# EasyEDA Pro project desain pcb.eprj

# Schematic Schematic1
Board Name: Board1; Create Date: 2026-02-26; Page Name: P1; Project Name: dapriz; Schematic Name: Schematic1; Update Date: 2026-02-26; Company: EasyEDA.com; Page Size: A4; Version: V1.0
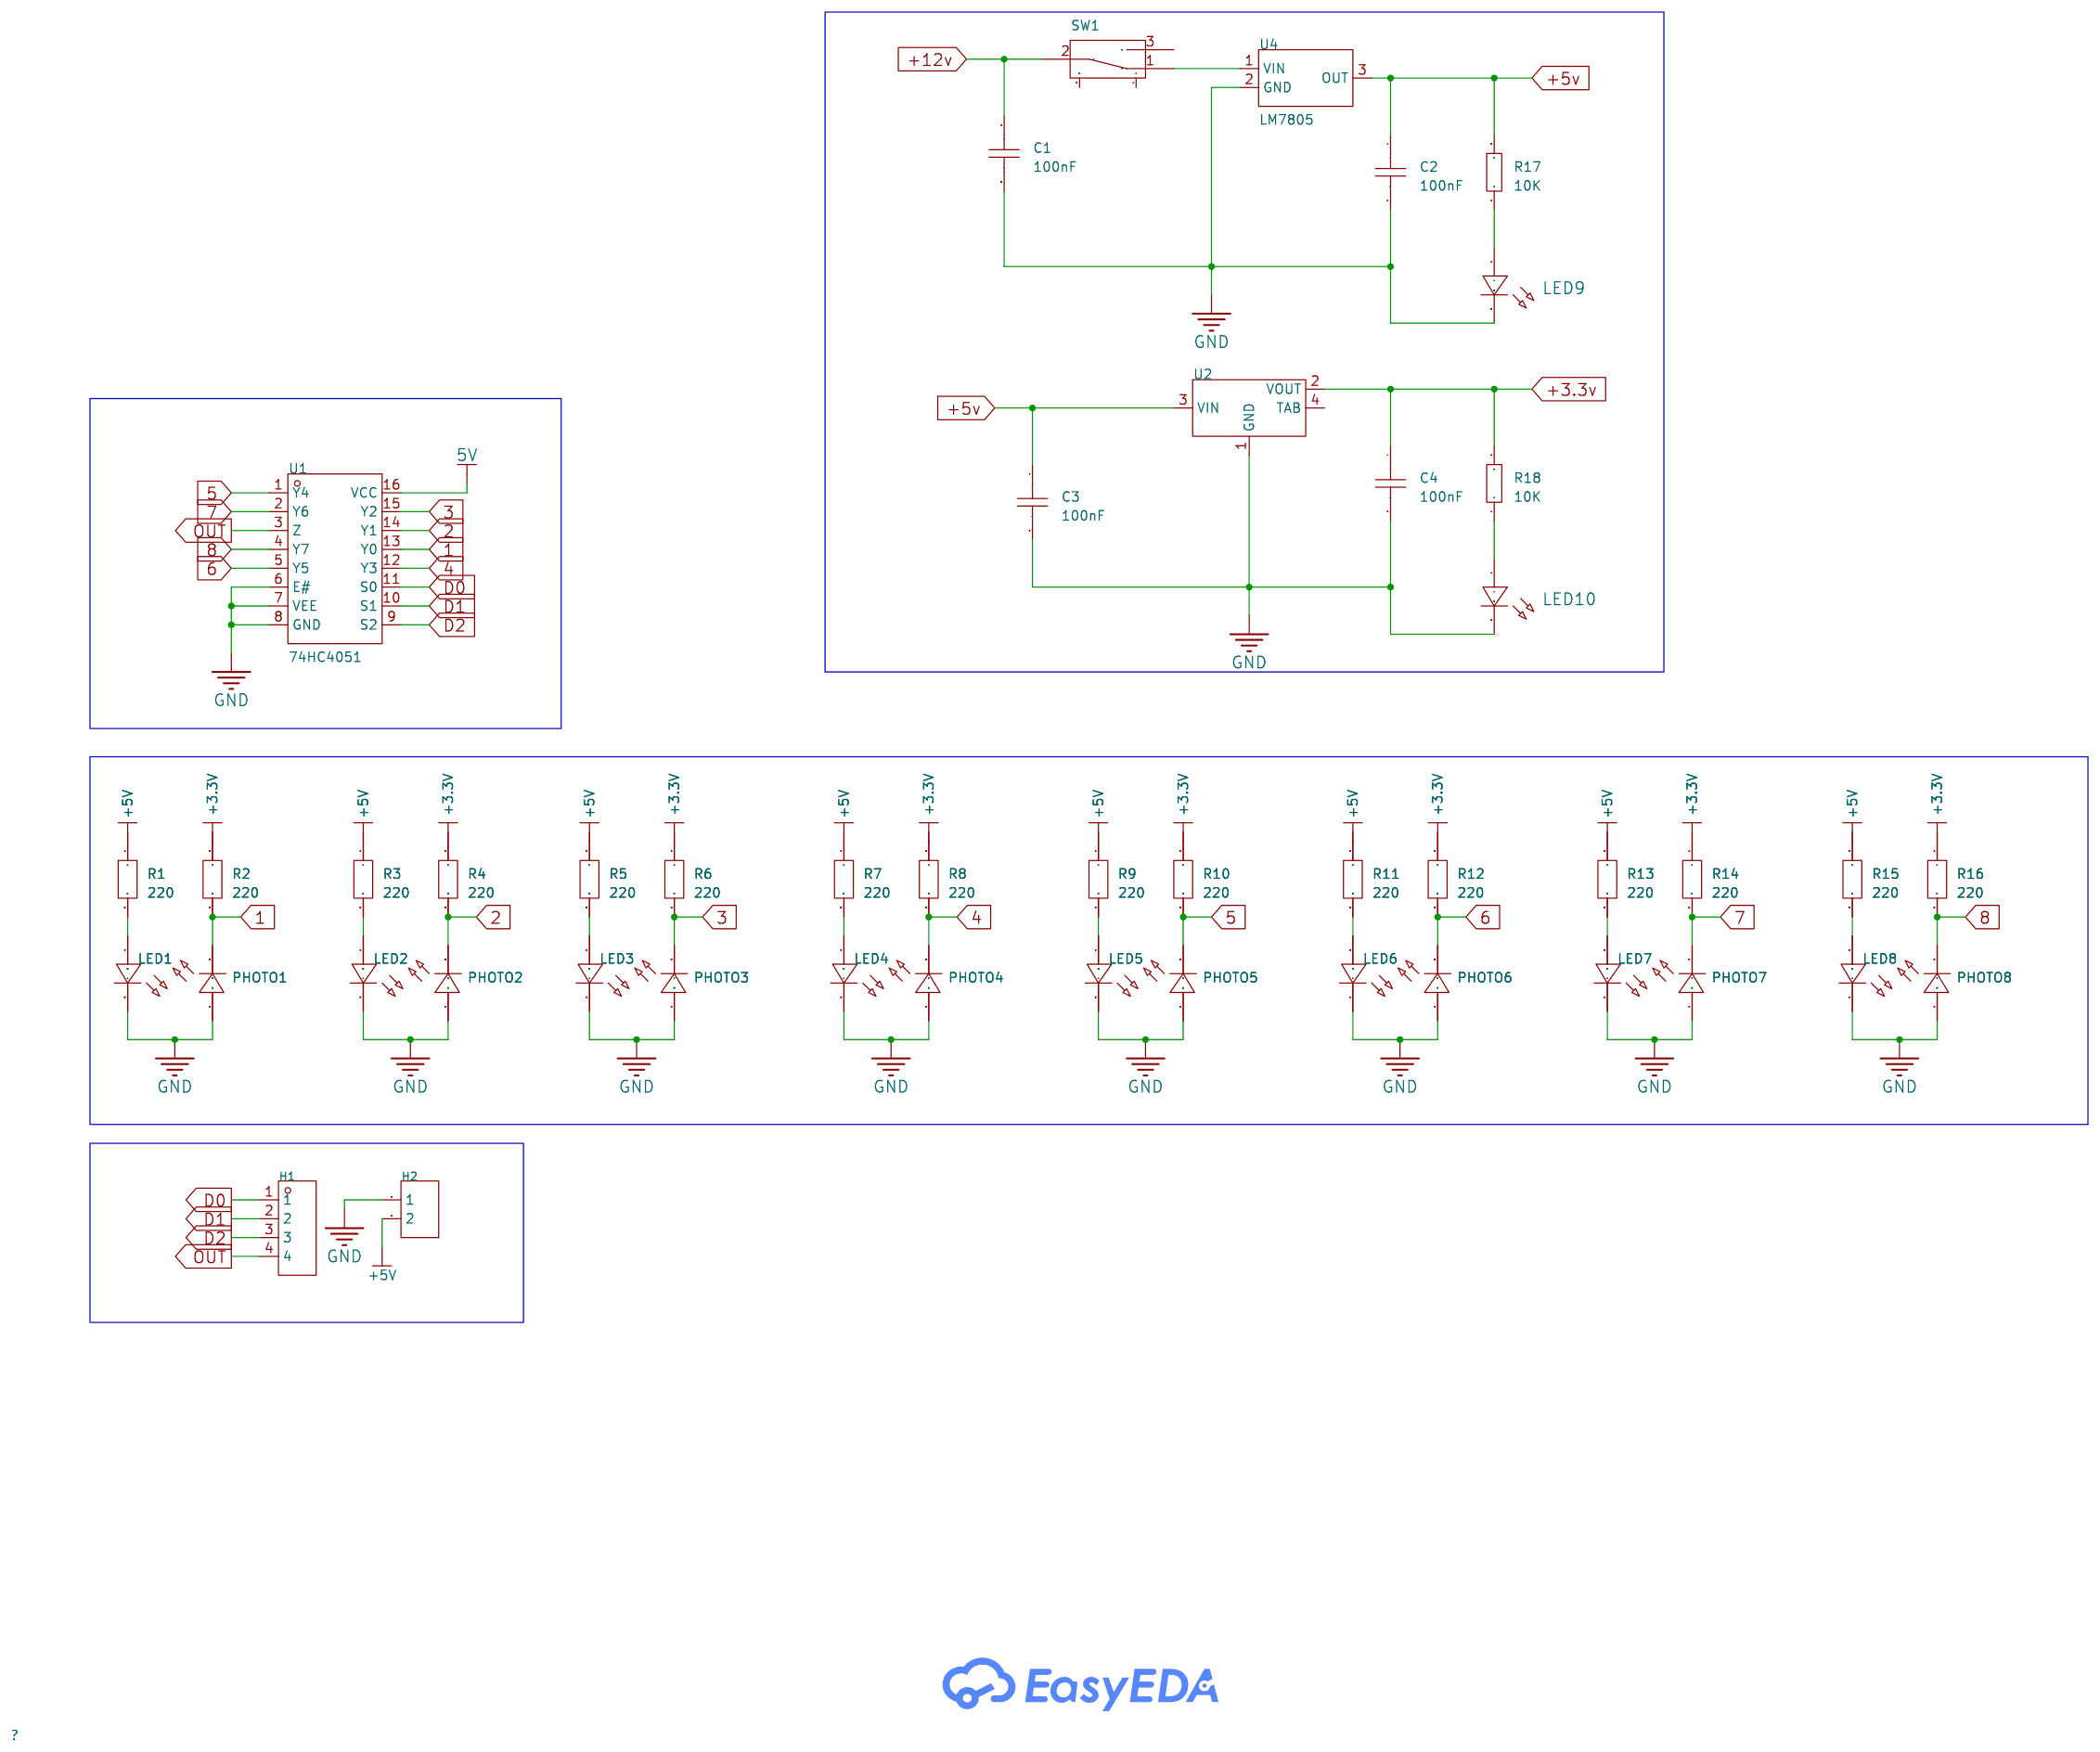
[diagram p0: schematic sheet]

## Parts
C1  100nF  [C0805]
C2  100nF  [C0805]
C3  100nF  [C0805]
C4  100nF  [C0805]
H1  -  [HDR-TH_4P-P2.54-V-F]
H2  -  [HDR-TH_2P-P2.54-V-F]
LED1  -  [LED-TH_BD3.0-P2.54-FD]
LED2  -  [LED-TH_BD3.0-P2.54-FD]
LED3  -  [LED-TH_BD3.0-P2.54-FD]
LED4  -  [LED-TH_BD3.0-P2.54-FD]
LED5  -  [LED-TH_BD3.0-P2.54-FD]
LED6  -  [LED-TH_BD3.0-P2.54-FD]
LED7  -  [LED-TH_BD3.0-P2.54-FD]
LED8  -  [LED-TH_BD3.0-P2.54-FD]
LED9  -  [LED0805-R-RD]
LED10  -  [LED0805-R-RD]
PHOTO1  -  [LED-TH_BD3.0-P2.54-FD]
PHOTO2  -  [LED-TH_BD3.0-P2.54-FD]
PHOTO3  -  [LED-TH_BD3.0-P2.54-FD]
PHOTO4  -  [LED-TH_BD3.0-P2.54-FD]
PHOTO5  -  [LED-TH_BD3.0-P2.54-FD]
PHOTO6  -  [LED-TH_BD3.0-P2.54-FD]
PHOTO7  -  [LED-TH_BD3.0-P2.54-FD]
PHOTO8  -  [LED-TH_BD3.0-P2.54-FD]
R1  220  [R0805]
R2  220  [R0805]
R3  220  [R0805]
R4  220  [R0805]
R5  220  [R0805]
R6  220  [R0805]
R7  220  [R0805]
R8  220  [R0805]
R9  220  [R0805]
R10  220  [R0805]
R11  220  [R0805]
R12  220  [R0805]
R13  220  [R0805]
R14  220  [R0805]
R15  220  [R0805]
R16  220  [R0805]
R17  10K  [R0603]
R18  10K  [R0603]
SW1  -  [SW-TH_SK12D07VG3]
U1  74HC4051  [SOP-16_L9.9-W3.9-P1.27-LS6.0-BL]
U2  -  [SOT-223-4_L6.5-W3.5-P2.30-LS7.0-BR]
U4  LM7805  [TO-252-2_L6.6-W6.1-P4.57-LS10.1-BL-1]

## Library data of the parts
C1-C4 = CAP_0805: Supplier Footprint: 0805
H1 = HDR-F_2.54_1x4P: Supplier Footprint: Through
H2 = HDR-F_2.54_1x2P: Supplier Footprint: Through
LED1-LED8 = LED_TH-R_3mm: Supplier Footprint: Through
LED9 LED10 = LED_0805-R: Supplier Footprint: 0805
PHOTO1-PHOTO8 = LED_TH-G_3mm: Supplier Footprint: Through
R1-R16 = PTFR0805B549RP9: Type:Thin Film Resistor Resistance: Tolerance:±0.1% Tolerance:±0.1% Power(Watts):130mW Overload Voltage (Max): Temperature Coefficient:±25ppm/℃ Temperature Coefficient:±25ppm/℃ Operating Temperature Range:-55℃~+155℃ Operating Temperature Range:-55℃~+155℃; LCSC Part Name: 薄膜电阻 549Ω ±0.1% 130mW; Supplier Part: C2849270; Manufacturer: RESI(开步睿思); Supplier Footprint: 0805; JLCPCB Part Class: Extended Part; Datasheet: https://atta.szlcsc.com/upload/public/pdf/source/20240506/11BDC7478D84177AC2A5326A65B6EB29.pdf; Supplier: LCSC; Type: Thin Film Resistor; Tolerance: ±0.1%; Power(Watts): 130mW; Temperature Coefficient: ±25ppm/℃; Operating Temperature Range: -55℃~+155℃
R17 R18 = Res_0603: Supplier Footprint: 0603
SW1 = SK12D07VG3: Supplier Footprint: Through
U1 = 74HC4051: LCSC Part Name: 8路模拟,多路复用器/解复用器; Supplier Part: C2943297; Manufacturer: I-CORE(中微爱芯); Supplier Footprint: SOP-16; JLCPCB Part Class: Extended Part; Datasheet: https://item.szlcsc.com/datasheet/74HC4051/3325956.html; Supplier: LCSC
U2 = AMS1117-3.3V: Supplier Footprint: SOT-223
U4 = LM7805: Supplier Part: C9900021893; Supplier Footprint: TO-252-2; JLCPCB Part Class: Extended Part; Supplier: LCSC

## Nets
5V: U1.16(VCC)
+3.3V: R2.1 R4.1 R6.1 R8.1 R10.1 R12.1 R14.1 R16.1
+3.3v: C4.1 R18.2 U2.2(VOUT)
+5V: H2.2 R1.1 R3.1 R5.1 R7.1 R9.1 R11.1 R13.1 R15.1
+5v: C2.1 C3.1 R17.2 U2.3(VIN) U4.3(OUT)
+12v: C1.1 SW1.2
GND: C1.2 C2.2 C3.2 C4.2 H2.1 LED1.2(A) LED2.2(A) LED3.2(A) LED4.2(A) LED5.2(A) LED6.2(A) LED7.2(A) LED8.2(A) LED9.2(C) LED10.2(C) PHOTO1.1(C) PHOTO2.1(C) PHOTO3.1(C) PHOTO4.1(C) PHOTO5.1(C) PHOTO6.1(C) PHOTO7.1(C) PHOTO8.1(C) U1.6(E#) U1.7(VEE) U1.8(GND) U2.1(GND) U4.2(GND)
1: PHOTO1.2(A) R2.2 U1.13(Y0)
2: PHOTO2.2(A) R4.2 U1.14(Y1)
3: PHOTO3.2(A) R6.2 U1.15(Y2)
4: PHOTO4.2(A) R8.2 U1.12(Y3)
5: PHOTO5.2(A) R10.2 U1.1(Y4)
6: PHOTO6.2(A) R12.2 U1.5(Y5)
7: PHOTO7.2(A) R14.2 U1.2(Y6)
8: PHOTO8.2(A) R16.2 U1.4(Y7)
D0: H1.1 U1.11(S0)
D1: H1.2 U1.10(S1)
D2: H1.3 U1.9(S2)
OUT: H1.4 U1.3(Z)
$1N915: LED1.1(C) R1.2
$1N1095: LED2.1(C) R3.2
$1N1273: LED3.1(C) R5.2
$1N1451: LED4.1(C) R7.2
$1N1629: LED5.1(C) R9.2
$1N1807: LED6.1(C) R11.2
$1N1985: LED7.1(C) R13.2
$1N2163: LED8.1(C) R15.2
$1N4562: LED10.1(A) R18.1
$1N4566: LED9.1(A) R17.1
$1N4575: SW1.1 U4.1(VIN)

Not connected (* = marked no-connect by the designer): SW1 3 4 5; U2 4(TAB)

# Schematic Schematic2
Board Name: Board2; Create Date: 2026-02-26; Page Name: P1; Project Name: dapriz; Schematic Name: Schematic2; Update Date: 2026-02-27; Company: EasyEDA.com; Page Size: A4; Version: V1.0
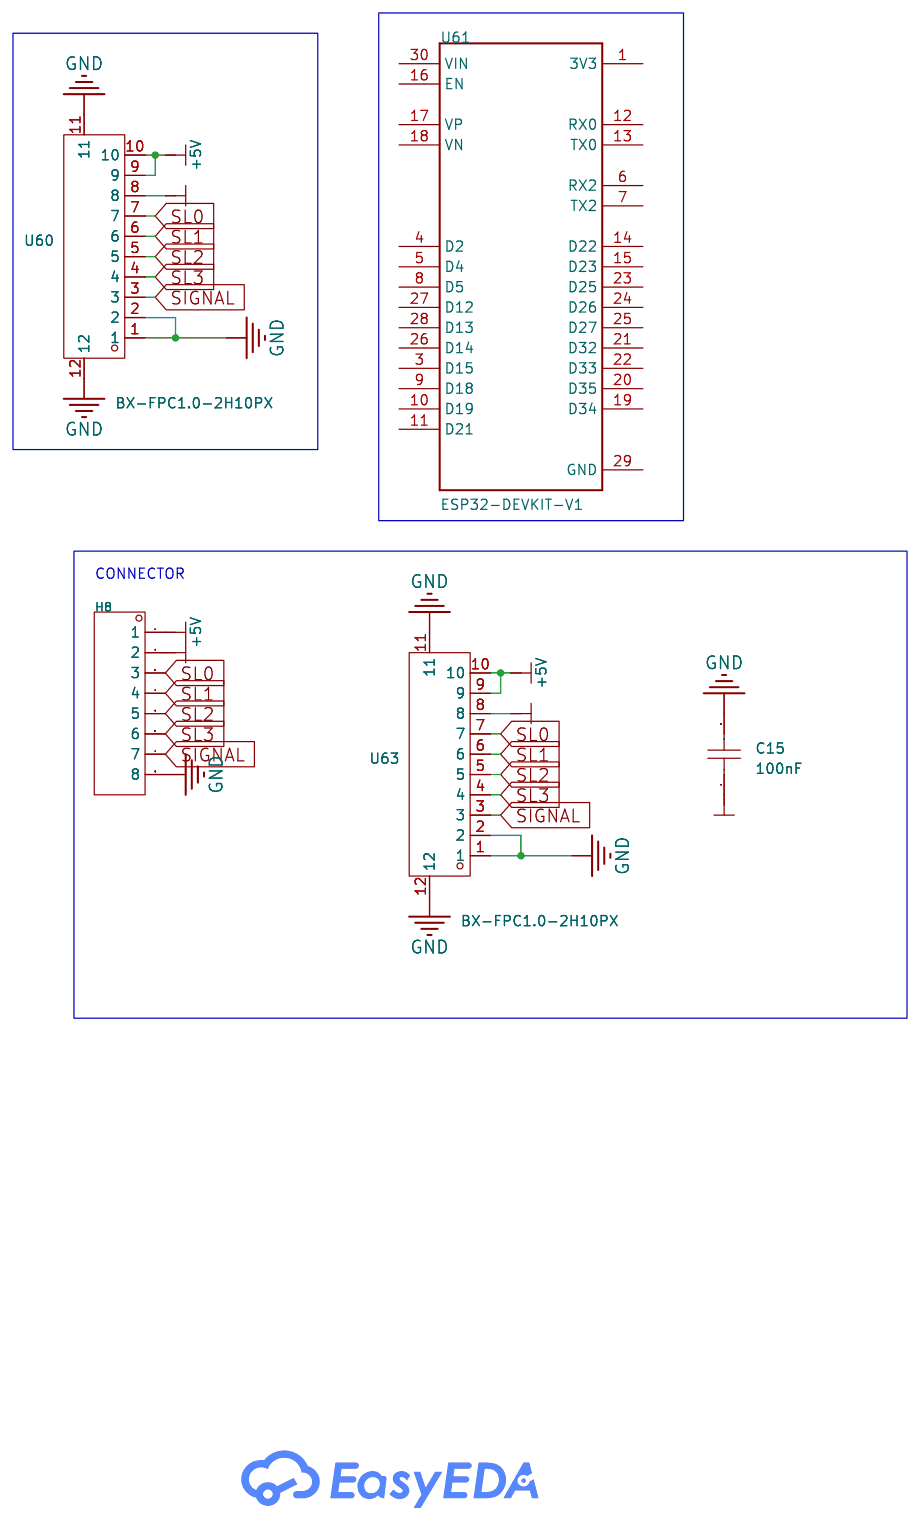
[diagram p1: schematic sheet]

## Parts
C15  100nF  [C0805]
H8  -  [HDR-TH_8P-P2.54-V-M]
U60  BX-FPC1.0-2H10PX  [FPC-SMD_10P-P1.00_BOSSIE_BX-FPC1.0-2H10PX]
U61  ESP32-DEVKIT-V1  [MODULE_ESP32_DEVKIT_V1]
U63  BX-FPC1.0-2H10PX  [FPC-SMD_10P-P1.00_BOSSIE_BX-FPC1.0-2H10PX]

## Library data of the parts
C15 = CAP_0805: Supplier Footprint: 0805
H8 = HDR-M_2.54_1x8P: Supplier Footprint: Through
U60 U63 = BX-FPC1.0-2H10PX: Locking Feature:Hinged Lid Contact Type:Bottom Contact Number of Contacts:10P Pitch:1mm Mounting Type:Surface Mount, Right Angle FFC, FCB Thickness:0.3mm FFC, FCB Thickness:0.3mm Height Above Board:2mm Contact Material:Copper Alloy Contact Plating:Tin Ope; LCSC Part Name: 翻盖式 下接 P数:10P 间距:1mm; Supplier Part: C18077668; Manufacturer: Bossie(博锡); Supplier Footprint: SMD,P=1mm,卧贴; JLCPCB Part Class: Extended Part; Datasheet: https://item.szlcsc.com/datasheet/BX-FPC1.0-2H10PX/19218069.html; Supplier: LCSC; Locking Feature: Hinged Lid; Contact Type: Bottom Contact; Number of Contacts: 10P; Pitch: 1mm; Mounting Type: Surface Mount, Right Angle; FFC, FCB Thickness: 0.3mm; Height Above Board: 2mm; Contact Material: Copper Alloy; Contact Plating: Tin; Operating Temperature: -25℃~+85℃
U61 = ESP32-DEVKIT-V1

## Nets
+3.3V: C15.1 H8.2 U60.8 U63.8
+5V: H8.1 U60.9 U60.10 U63.9 U63.10
GND: C15.2 H8.8 U60.1 U60.2 U60.11 U60.12 U63.1 U63.2 U63.11 U63.12
SIGNAL: H8.7 U60.3 U63.3
SL0: H8.3 U60.7 U63.7
SL1: H8.4 U60.6 U63.6
SL2: H8.5 U60.5 U63.5
SL3: H8.6 U60.4 U63.4

Not connected (* = marked no-connect by the designer): U61 1(3V3) 3(D15) 4(D2) 5(D4) 6(RX2) 7(TX2) 8(D5) 9(D18) 10(D19) 11(D21) 12(RX0) 13(TX0) 14(D22) 15(D23) 16(EN) 17(VP) 18(VN) 19(D34) 20(D35) 21(D32) 22(D33) 23(D25) 24(D26) 25(D27) 26(D14) 27(D12) 28(D13) 29(GND) 30(VIN)

## Notes on the sheet
- CONNECTOR

# Board PCB1
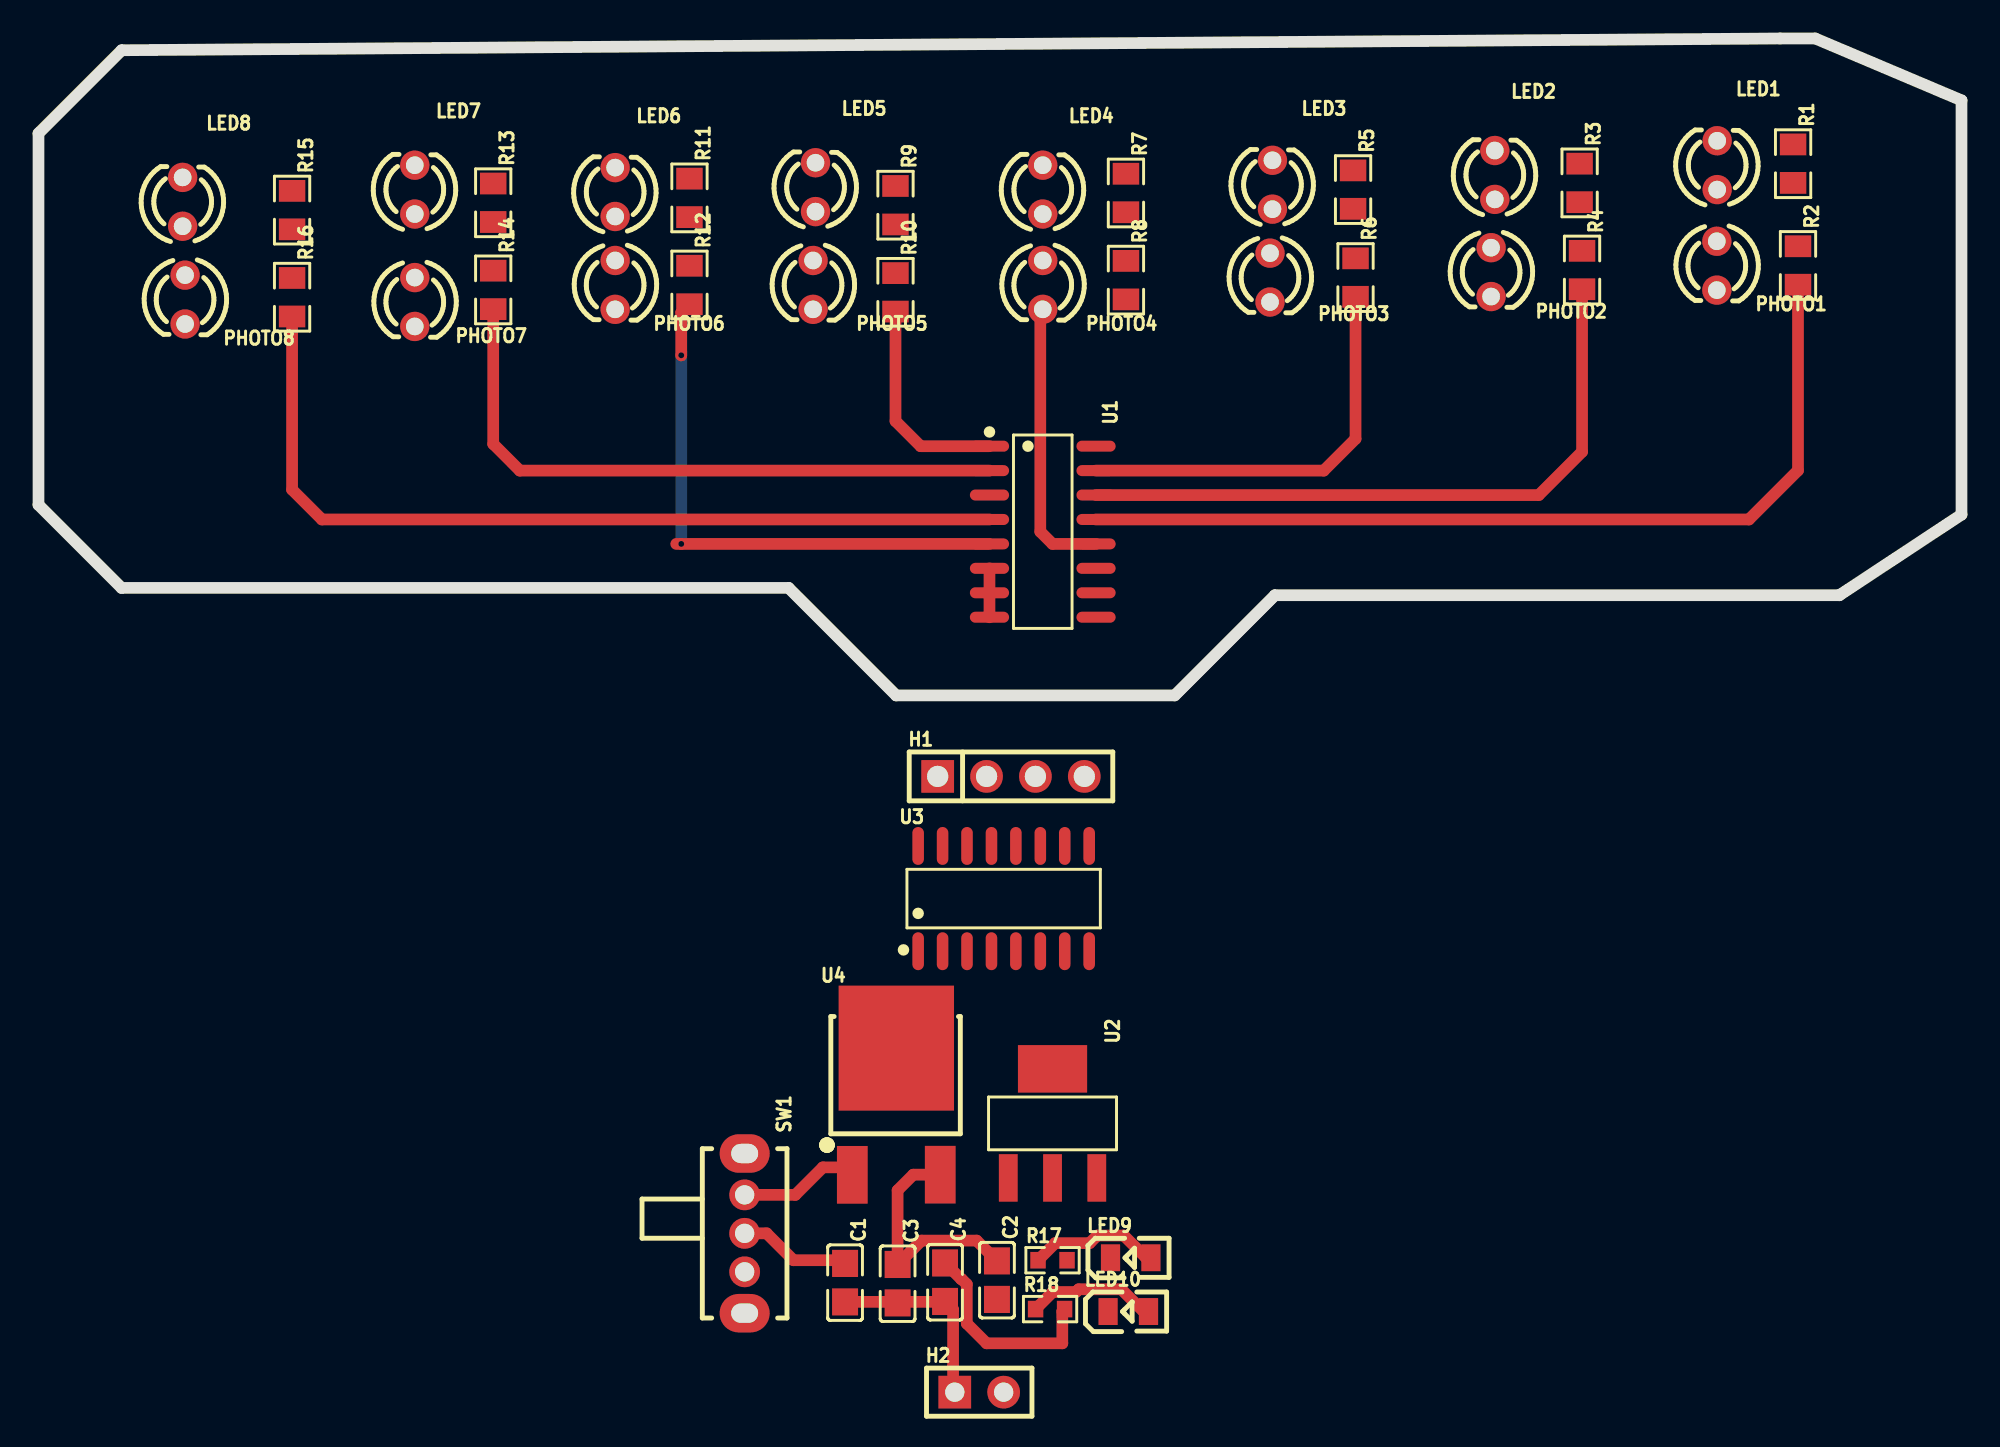
[diagram p2: board, top side]
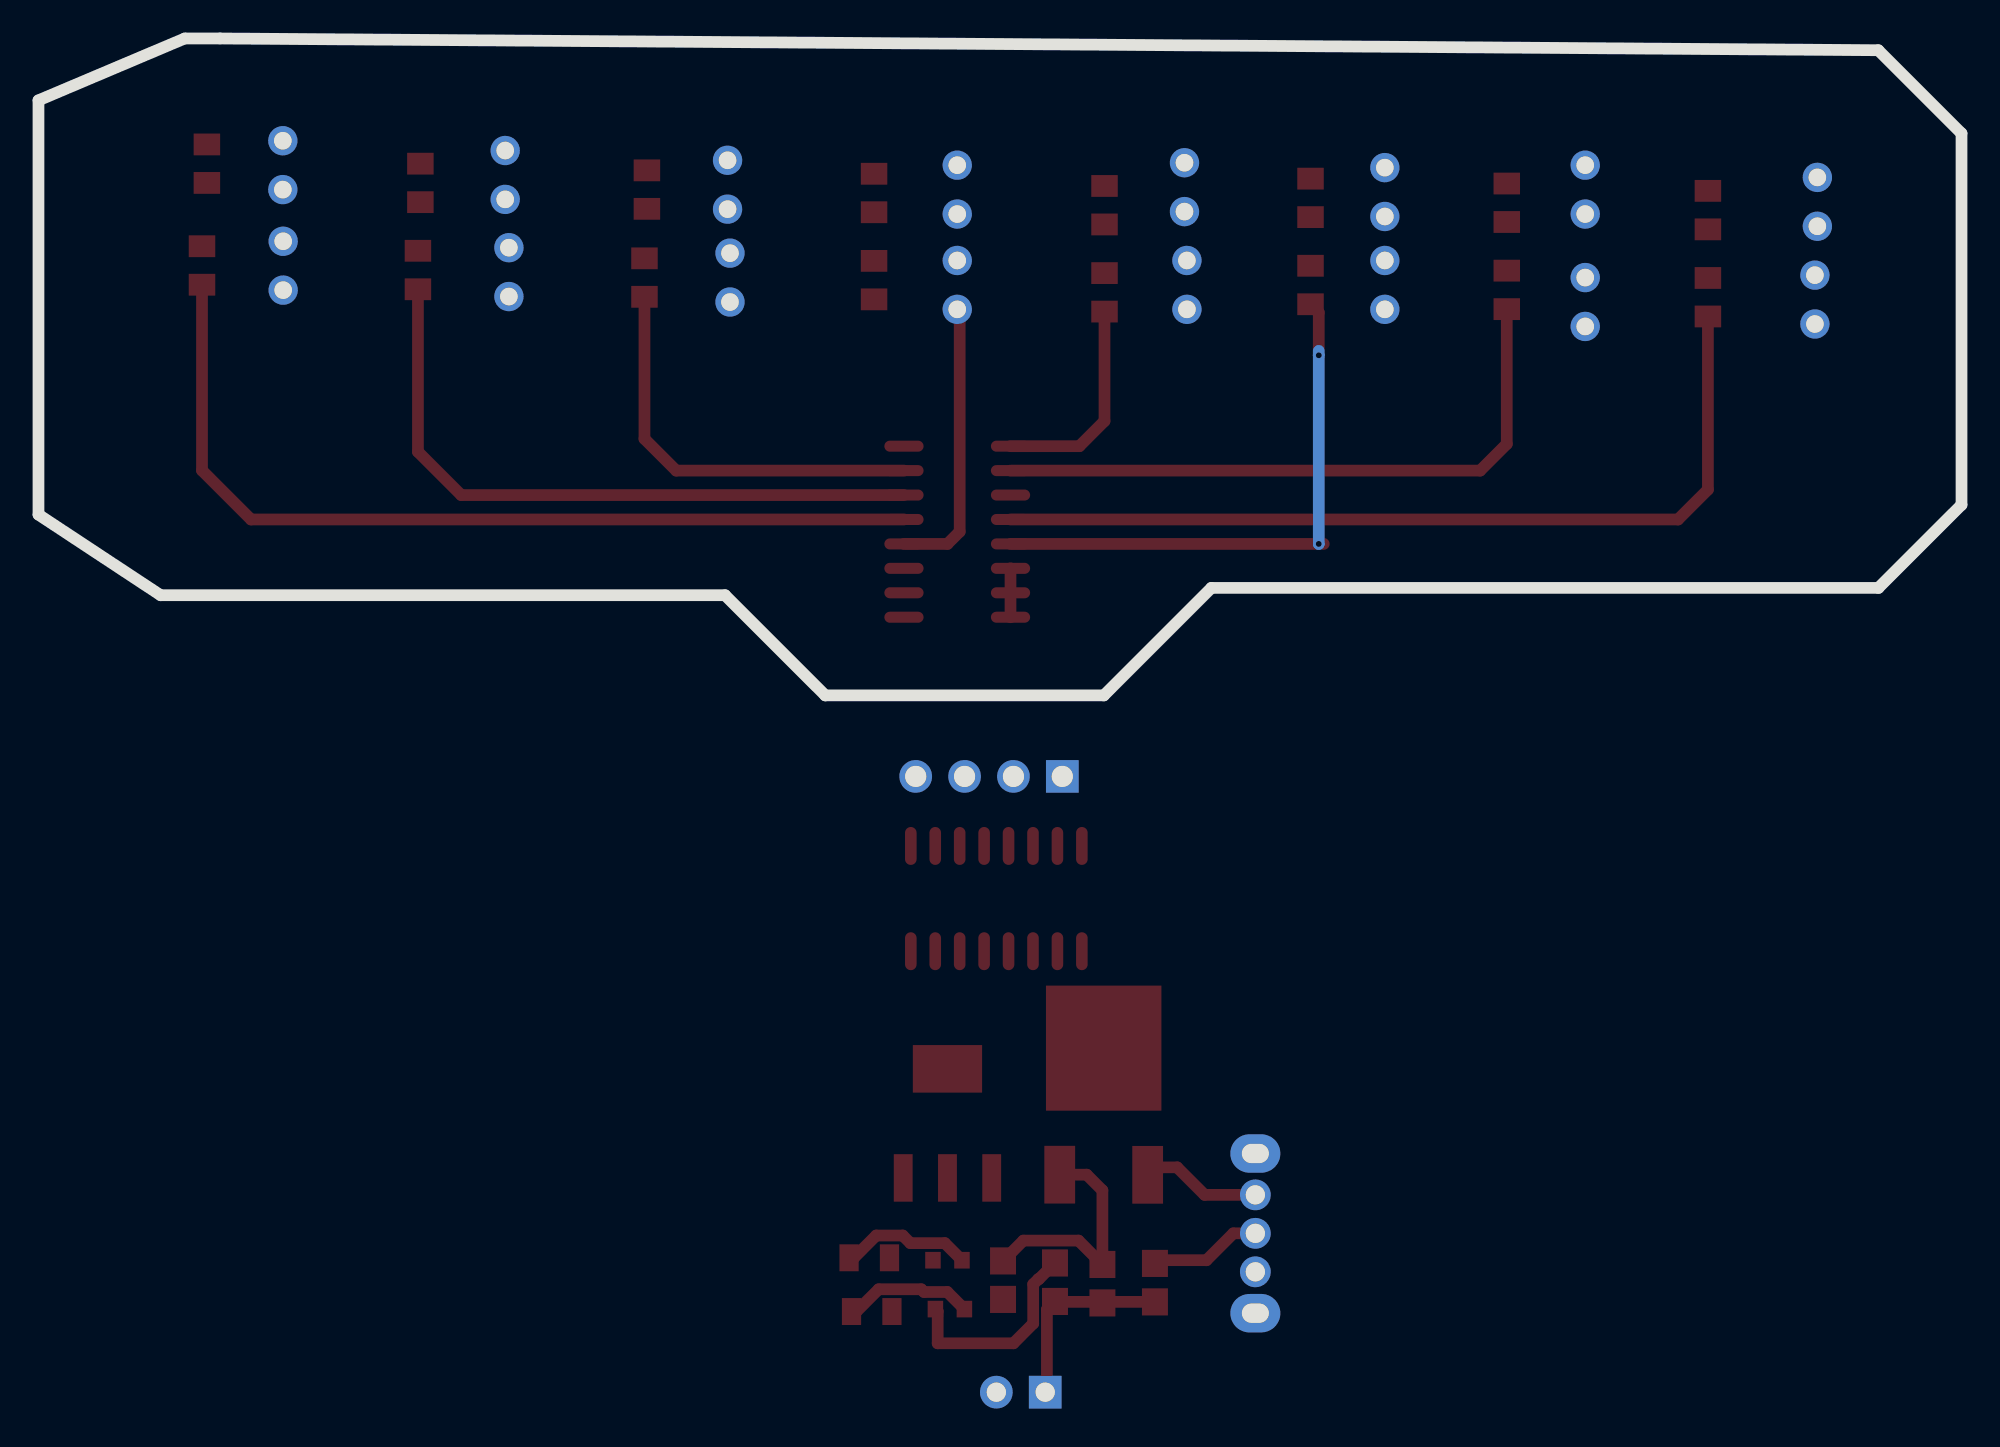
[diagram p3: board, bottom side, seen from below]

Outline 99.95 x 34.14 mm; copper layers: Top Layer, Bottom Layer. Coordinates in mm from the lower left corner of the outline.
Outline path: 0,29.21 0,9.91 4.32,5.59 38.99,5.59 44.58,0 59.05,0 64.26,5.21 93.6,5.21 99.95,9.4 99.95,30.93 92.35,34.14 90.52,34.14 4.32,33.53 0,29.21
Stack: Top Layer 0.035mm / Dielectric1 1.51mm FR4 er 4.5 / Bottom Layer 0.035mm

## Design rules (mm)
template: JLCPCB Capability(Two Layers Board)
spacing copperThickness1oz (default): track to track 0.102, other pairs 0.152 to 0.3
spacing copperThickness2oz: track to track 0.203, other pairs 0.152 to 0.3
track width copperThickness1oz (default): min 0.127, default 0.254, max 2.54
track width copperThickness2oz: min 0.203, default 0.254, max 2.54
differential pair differentialPair (default): width min 0.127, default 0.254, max 2.54; gap min 0.152, default 0.152
via viaSize (default): diameter min 0.5, default 0.61, max 10; hole min 0.3, default 0.305, max 6.3

## Placement (name value [footprint] x y rotation side)
C1  100nF  [C0805]  41.92 -30.52 270 top
C2  100nF  [C0805]  49.82 -30.39 270 top
C3  100nF  [C0805]  44.65 -30.58 270 top
C4  100nF  [C0805]  47.12 -30.5 270 top
H1  -  [HDR-TH_4P-P2.54-V-F]  50.55 -4.21 0 top
H2  -  [HDR-TH_2P-P2.54-V-F]  48.89 -36.21 0 top
LED1  -  [LED-TH_BD3.0-P2.54-FD]  87.25 27.56 90 top
LED2  -  [LED-TH_BD3.0-P2.54-FD]  75.69 27.05 90 top
LED3  -  [LED-TH_BD3.0-P2.54-FD]  64.14 26.54 90 top
LED4  -  [LED-TH_BD3.0-P2.54-FD]  52.2 26.29 90 top
LED5  -  [LED-TH_BD3.0-P2.54-FD]  40.39 26.42 90 top
LED6  -  [LED-TH_BD3.0-P2.54-FD]  29.97 26.16 90 top
LED7  -  [LED-TH_BD3.0-P2.54-FD]  19.56 26.29 90 top
LED8  -  [LED-TH_BD3.0-P2.54-FD]  7.49 25.65 90 top
LED9  -  [LED0805-R-RD]  56.77 -29.23 0 top
LED10  -  [LED0805-R-RD]  56.64 -32.02 0 top
PHOTO1  -  [LED-TH_BD3.0-P2.54-FD]  87.23 22.33 270 top
PHOTO2  -  [LED-TH_BD3.0-P2.54-FD]  75.5 22 270 top
PHOTO3  -  [LED-TH_BD3.0-P2.54-FD]  64.01 21.72 270 top
PHOTO4  -  [LED-TH_BD3.0-P2.54-FD]  52.2 21.34 270 top
PHOTO5  -  [LED-TH_BD3.0-P2.54-FD]  40.26 21.34 270 top
PHOTO6  -  [LED-TH_BD3.0-P2.54-FD]  29.97 21.34 270 top
PHOTO7  -  [LED-TH_BD3.0-P2.54-FD]  19.56 20.45 270 top
PHOTO8  -  [LED-TH_BD3.0-P2.54-FD]  7.62 20.57 270 top
R1  220  [R0805]  91.2 27.64 270 top
R2  220  [R0805]  91.45 22.35 270 top
R3  220  [R0805]  80.1 26.64 270 top
R4  220  [R0805]  80.23 22.11 270 top
R5  220  [R0805]  68.33 26.29 270 top
R6  220  [R0805]  68.45 21.72 270 top
R7  220  [R0805]  56.52 26.11 270 top
R8  220  [R0805]  56.52 21.58 270 top
R9  220  [R0805]  44.54 25.48 270 top
R10  220  [R0805]  44.54 20.95 270 top
R11  220  [R0805]  33.83 25.86 270 top
R12  220  [R0805]  33.83 21.33 270 top
R13  220  [R0805]  23.63 25.61 270 top
R14  220  [R0805]  23.63 21.08 270 top
R15  220  [R0805]  13.18 25.22 270 top
R16  220  [R0805]  13.18 20.7 270 top
R17  10K  [R0603]  52.7 -29.36 0 top
R18  10K  [R0603]  52.58 -31.9 0 top
SW1  -  [SW-TH_SK12D07VG3]  36.7 -27.96 270 top
U1  74HC4051  [SOP-16_L9.9-W3.9-P1.27-LS6.0-BL]  52.2 8.51 270 top
U2  -  [SOT-223-4_L6.5-W3.5-P2.30-LS7.0-BR]  52.7 -22.24 270 top
U3  74HC4051D,653  [SOIC-16_L9.9-W3.9-P1.27-LS6.0-BL]  50.17 -10.56 0 top
U4  LM7805  [TO-252-2_L6.6-W6.1-P4.57-LS10.1-BL-1]  44.58 -21.63 0 top

## Footprints (pads in the part's own frame, mm; a bottom-side part is the same pattern mirrored in y, then rotated)
C0805
  rect 1.41x1.35 smd: 1(-1,0) 2(1,0)
HDR-TH_2P-P2.54-V-F
  rect 1.7x1.7 hole 1: 1(-1.27,0)
  round 1.7 hole 1: 2(1.27,0)
HDR-TH_4P-P2.54-V-F
  rect 1.7x1.7 hole 1.1: 1(-3.81,0)
  round 1.7 hole 1.1: 2(-1.27,0) 3(1.27,0) 4(3.81,0)
LED0805-R-RD
  rect 1x1.399 smd: 1(1.05,0) 2(-1.05,0)
LED-TH_BD3.0-P2.54-FD
  round 1.524 hole 0.914: 1(-1.27,0) 2(1.27,0)
R0603
  rect 0.806x0.864 smd: 1(-0.753,0) 2(0.753,0)
R0805
  rect 1.133x1.377 smd: 1(-1,0) 2(1,0)
SOIC-16_L9.9-W3.9-P1.27-LS6.0-BL
  oval 0.602x1.971 smd: 1(-4.445,-2.736) 2(-3.175,-2.736) 3(-1.905,-2.736) 4(-0.635,-2.736) 5(0.635,-2.736) 6(1.905,-2.736) 7(3.175,-2.736) 8(4.445,-2.736) 9(4.445,2.736) 10(3.175,2.736) 11(1.905,2.736) 12(0.635,2.736) 13(-0.635,2.736) 14(-1.905,2.736) 15(-3.175,2.736) 16(-4.445,2.736)
SOP-16_L9.9-W3.9-P1.27-LS6.0-BL
  oval 0.574x2.038 smd: 1(-4.445,-2.769) 2(-3.175,-2.769) 3(-1.905,-2.769) 4(-0.635,-2.769) 5(0.635,-2.769) 6(1.905,-2.769) 7(3.175,-2.769) 8(4.445,-2.769) 9(4.445,2.769) 10(3.175,2.769) 11(1.905,2.769) 12(0.635,2.769) 13(-0.635,2.769) 14(-1.905,2.769) 15(-3.175,2.769) 16(-4.445,2.769)
SOT-223-4_L6.5-W3.5-P2.30-LS7.0-BR
  rect 2.47x0.98 smd: 1(2.835,-2.3) 2(2.835,0) 3(2.835,2.3)
  rect 2.47x3.6 smd: 4(-2.835,0)
SW-TH_SK12D07VG3
  oval 1.6x1.6 hole 1: 1(-2,0) 2(0,0) 3(2,0)
  oval 2x2.6 hole 1x1.4: 4(4.15,0) 5(-4.15,0)
TO-252-2_L6.6-W6.1-P4.57-LS10.1-BL-1
  rect 1.6x3 smd: 1(-2.285,-3.292) 3(2.285,-3.285)
  rect 6x6.5 smd: 2(0,3.292)

## Nets
5V: U1.16
+3.3V: C4.1 R2.1 R4.1 R6.1 R8.1 R10.1 R12.1 R14.1 R16.1 R18.2 U2.2
+5V: C2.1 C3.1 H2.2 R1.1 R3.1 R5.1 R7.1 R9.1 R11.1 R13.1 R15.1 R17.2 U2.3 U3.16 U4.3
+12V: C1.1 SW1.2
GND: C1.2 C2.2 C3.2 C4.2 H2.1 LED1.2 LED2.2 LED3.2 LED4.2 LED5.2 LED6.2 LED7.2 LED8.2 LED9.2 LED10.2 PHOTO1.1 PHOTO2.1 PHOTO3.1 PHOTO4.1 PHOTO5.1 PHOTO6.1 PHOTO7.1 PHOTO8.1 U1.6 U1.7 U1.8 U2.1 U3.6 U3.7 U3.8 U4.2
1: PHOTO1.2 R2.2 U1.13
2: PHOTO2.2 R4.2 U1.14
3: PHOTO3.2 R6.2 U1.15
4: PHOTO4.2 R8.2 U1.12
5: PHOTO5.2 R10.2 U1.1
6: PHOTO6.2 R12.2 U1.5
7: PHOTO7.2 R14.2 U1.2
8: PHOTO8.2 R16.2 U1.4
D0: U1.11
D1: U1.10
D2: U1.9
OUT: H1.4 U1.3 U3.3
SENSOR1: U3.13
SENSOR2: U3.14
SENSOR3: U3.15
SENSOR4: U3.12
SENSOR5: U3.1
SENSOR6: U3.5
SENSOR7: U3.2
SENSOR8: U3.4
SLC0: H1.1 U3.11
SLC1: H1.2 U3.10
SLC2: H1.3 U3.9
$1N915: LED1.1 R1.2
$1N1095: LED2.1 R3.2
$1N1273: LED3.1 R5.2
$1N1451: LED4.1 R7.2
$1N1629: LED5.1 R9.2
$1N1807: LED6.1 R11.2
$1N1985: LED7.1 R13.2
$1N2163: LED8.1 R15.2
$1N4562: LED10.1 R18.1
$1N4566: LED9.1 R17.1
$1N4575: SW1.1 U4.1

Pads without a net: SW1 3 4 5; U2 4

## Via types
v1: diameter 0.61, hole 0.305, Top Layer to Bottom Layer, 2 vias

## Routing (per net, layer and track width the routed paths; a pad name or vN(x,y) marks a point on that pad's centre or on a via; arc(x,y) is an arc through that point)
+3.3V: length 10.8
  Top Layer w0.61: R18.2 53.21,-32.01 53.21,-33.67 49.28,-33.67 48.25,-32.65 48.25,-30.61 47.98,-30.34 47.95,-30.34 C4.1
+5V: length 12.5
  Top Layer w0.61: U4.3 45.47,-24.91 44.65,-25.72 C3.1 45.89,-28.34 48.76,-28.34 C2.1
+12V: length 5.9
  Top Layer w0.61: C1.1 41.76,-29.36 39.24,-29.36 37.85,-27.96 SW1.2
GND: length 12.7
  Top Layer w0.61: 44.6,-31.52 47.09,-31.52 C4.2 47.54,-31.92 47.54,-36.13 H2.1 ; 44.6,-31.52 C1.2 ; 44.6,-31.52 C3.2 ; U1.8 U1.7 U1.6
1: length 47.2
  Top Layer w0.61: R2.2 91.45,11.69 88.9,9.14 U1.13
2: length 34.6
  Top Layer w0.61: U1.14 77.98,10.41 80.23,12.66 R4.2
3: length 21.6
  Top Layer w0.61: U1.15 66.8,11.68 68.45,13.34 R6.2
4: length 14.8
  Top Layer w0.61: U1.12 52.7,7.87 52.07,8.51 52.07,19.94 PHOTO4.2
5: length 11.1
  Top Layer w0.61: U1.1 45.85,12.95 44.54,14.26 R10.2
6: length 29.1
  Top Layer w0.61: v1(33.41,17.68) 33.41,19.9 R12.2 ; U1.5 33.15,7.87
  Bottom Layer w0.61: v1(33.41,7.87) 33.41,17.91
7: length 33.4
  Top Layer w0.61: U1.2 25.02,11.68 23.63,13.07 R14.2
8: length 45.9
  Top Layer w0.61: R16.2 13.18,10.7 14.73,9.14 U1.4
$1N4562: length 6.8
  Top Layer w0.61: LED10.1 57.44,-32.02 56.28,-30.87 54.06,-30.87 53.92,-31.01 52.71,-31.01 R18.1
$1N4566: length 6.9
  Top Layer w0.61: R17.1 52.84,-28.47 54.63,-28.47 55.03,-28.07 56.41,-28.07 57.56,-29.23 LED9.1
$1N4575: length 6.3
  Top Layer w0.61: SW1.1 39.34,-25.96 40.77,-24.53 41.91,-24.53 U4.1
